# EAGLE design Pluvion 1 - Rev B (EAGLE 7.3.0)

## Sheet 1 of 3
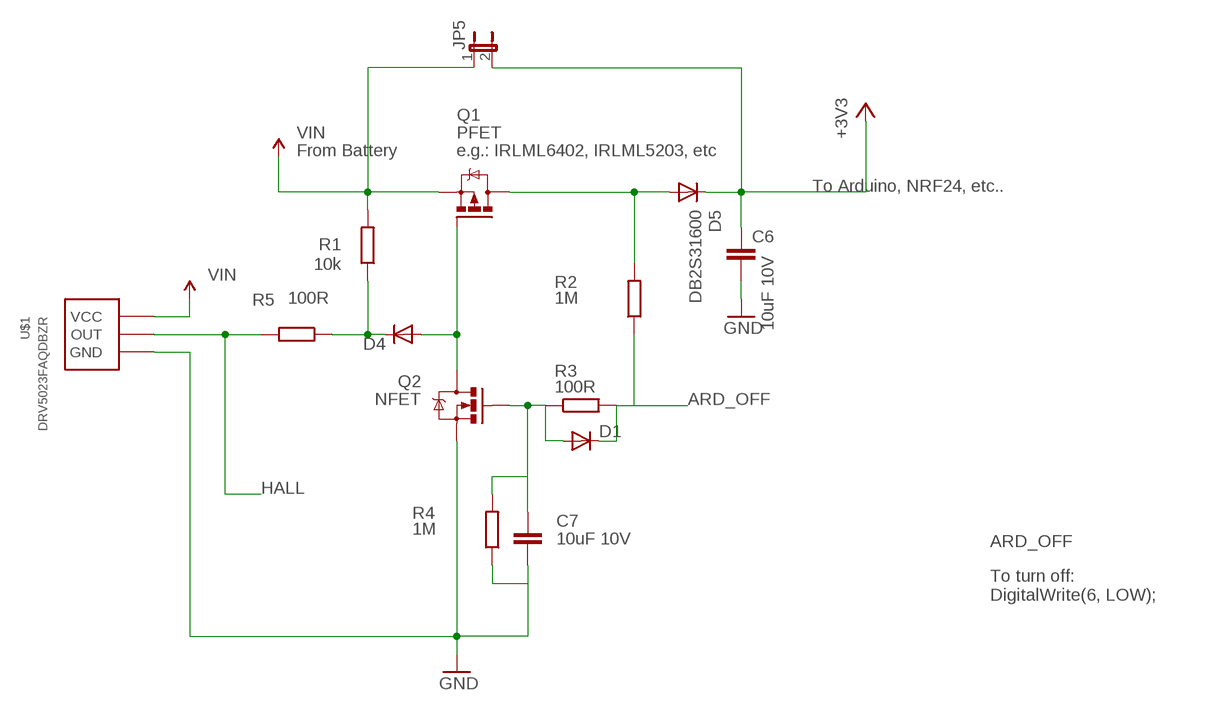
[diagram p0: schematic, sheet 1]

### Parts
C6  10uF 10V  C-EUC0805  [C0805]
C7  10uF 10V  C-EUC0805  [C0805]
D1  DIODESMB  [SMB-DIODE]
D4  DIODESMB  [SMB-DIODE]
D5  DB2S31600  DIODESMB  [SMB-DIODE]
JP5  JUMPER-2PTH  [1X02]
Q1  PFET  IRLML5203  [MICRO3]
Q2  NFET  MOSFET-NCHANNELBSS123LT1G  [SOT23]
R1  10k  R-EU_R0805  [R0805]
R2  1M  R-EU_R0805  [R0805]
R3  100R  R-EU_R0805  [R0805]
R4  1M  R-EU_R0805  [R0805]
R5  100R  R-EU_R0805  [R0805]
U$1  DRV5023FAQDBZR  [SOT23]

### Nets
+3V3: C6.1 D5.C JP5.2 ; also sheet 3
ARD_OFF: D1.C R2.1 R3.2 ; also sheet 3
BUTTONS: D4.A Q1.1(G) Q2.3(D)
GND: C6.2 C7.2 Q2.2(S) R4.1 U$1.3(GND) ; also sheet 3
HALL: R5.2 U$1.2(OUT)
N$1: D5.A Q1.3(D) R2.2
N$2: C7.1 D1.A Q2.1(G) R3.1 R4.2
N$8: D4.C R1.1 R5.1
VIN: JP5.1 Q1.2(S) R1.2 U$1.1(VCC)

### Notes on the sheet
- From Battery | e.g.: IRLML6402, IRLML5203, etc
- To Arduino, NRF24, etc..
- To turn off:
  DigitalWrite(6, LOW);

## Sheet 2 of 3

## Sheet 3 of 3
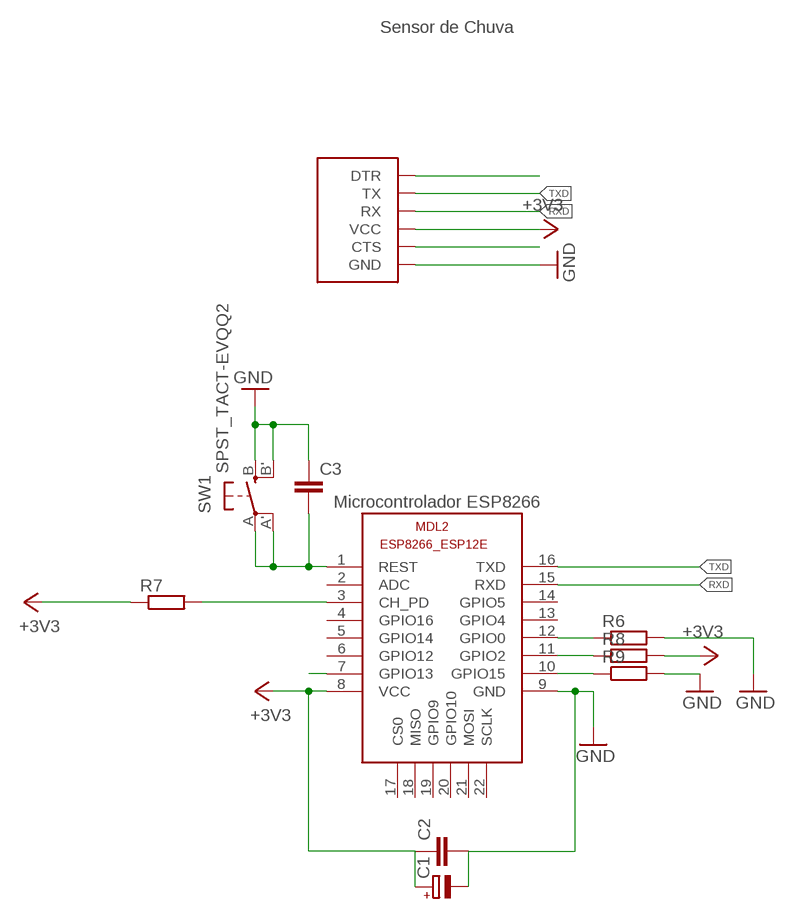
[diagram p1: schematic, sheet 3]

### Parts
C1  CPOL-EUC  [PANASONIC_C]
C2  C-EUC0805  [C0805]
C3  C-EUC0805  [C0805]
MDL2  ESP8266-12EESP8266-ESP12E  [ESP8266-ESP12E]
R6  R-EU_R0805  [R0805]
R7  R-EU_R0805  [R0805]
R8  R-EU_R0805  [R0805]
R9  R-EU_R0805  [R0805]
SW1  SPST_TACT-EVQQ2  [EVQ-Q2]
U$2  FTDI_HEADERSMD  [FTDI_HEADER_SMD]

### Nets
+3V3: C1.+ C2.1 MDL2.8(VCC) R7.1 R8.2 U$2.VCC ; also sheet 1
ARD_OFF: MDL2.7(GPIO13) ; also sheet 1
GND: C1.- C2.2 C3.1 MDL2.9(GND) R6.2 R9.2 SW1.B'(S1) SW1.B(S) U$2.GND ; also sheet 1
N$3: C3.2 MDL2.1(REST) SW1.A'(P1) SW1.A(P)
N$4: MDL2.3(CH_PD) R7.2
N$5: MDL2.12(GPIO0) R6.1
N$7: MDL2.11(GPIO2) R8.1
N$9: MDL2.10(GPIO15) R9.1
N$14: U$2.DTR
N$18: U$2.CTS
RXD: MDL2.15(RXD) U$2.RX
TXD: MDL2.16(TXD) U$2.TX
Unconnected: MDL2.2(ADC) MDL2.4(GPIO16) MDL2.5(GPIO14) MDL2.6(GPIO12) MDL2.13(GPIO4) MDL2.14(GPIO5) MDL2.17(CS0) MDL2.18(MISO) MDL2.19(GPIO9) MDL2.20(GPIO10) MDL2.21(MOSI) MDL2.22(SCLK)

### Notes on the sheet
- Sensor de Chuva
- Microcontrolador ESP8266

## Library data of the parts
C1 = wes:CPOL-EU: POLARIZED CAPACITOR, European symbol
C2 C3 C6 C7 = wes:C-EU: CAPACITOR, European symbol
D1 D4 D5 = SparkFun-DiscreteSemi:DIODE: Diode These are standard reverse protection diodes and small signal diodes. SMA package can handle up to about 1A. SOD-323 can handle about 200mA. What the SOD-323 package when ordering, there are some mfgs out there that are 5-pin packages.
JP5 = SparkFun-Passives:JUMPER-2: Jumper Basic 0.1" spaced jumper. Use with breakaway headers.
MDL2 = ESP8266-ESP12E:ESP8266-12E: ESP8266-12E with additional I/O and GPIO04/05 corrected The author cannot warrant that this library is free from error or will meet your specific requirements. Created by PuceBaboon.com. Komagane, Nagano, JAPAN
Q1 = transistor-power:IRLML5203: HEXFET P-Channel Power MOSFET
Q2 = SparkFun-DiscreteSemi:MOSFET-NCHANNEL: Common NMOSFET Parts MFG P/N Store ID Prod ID FDD8780 TRANS-09984 SI7820DN TRANS-11055 FDS6630A IC-08089 2N7002PW TRANS-11151 FQP30N06L COM-10213 TRANS-10060 BSS123LT1G TRANS-08345 BSS138 TRANS-00830 BS170 2N7000; PROD_ID: TRANS-08345
R1-R9 = wes:R-EU_: RESISTOR, European symbol
SW1 = adafruit:SPST_TACT: SMT 6mm switch, EVQQ2 series http://www.ladyada.net/library/eagle
U$1 = lib_pluvion:DRV5023FAQDBZR: Digital Switch Hall Sensor
U$2 = wes:FTDI_HEADER

## Board
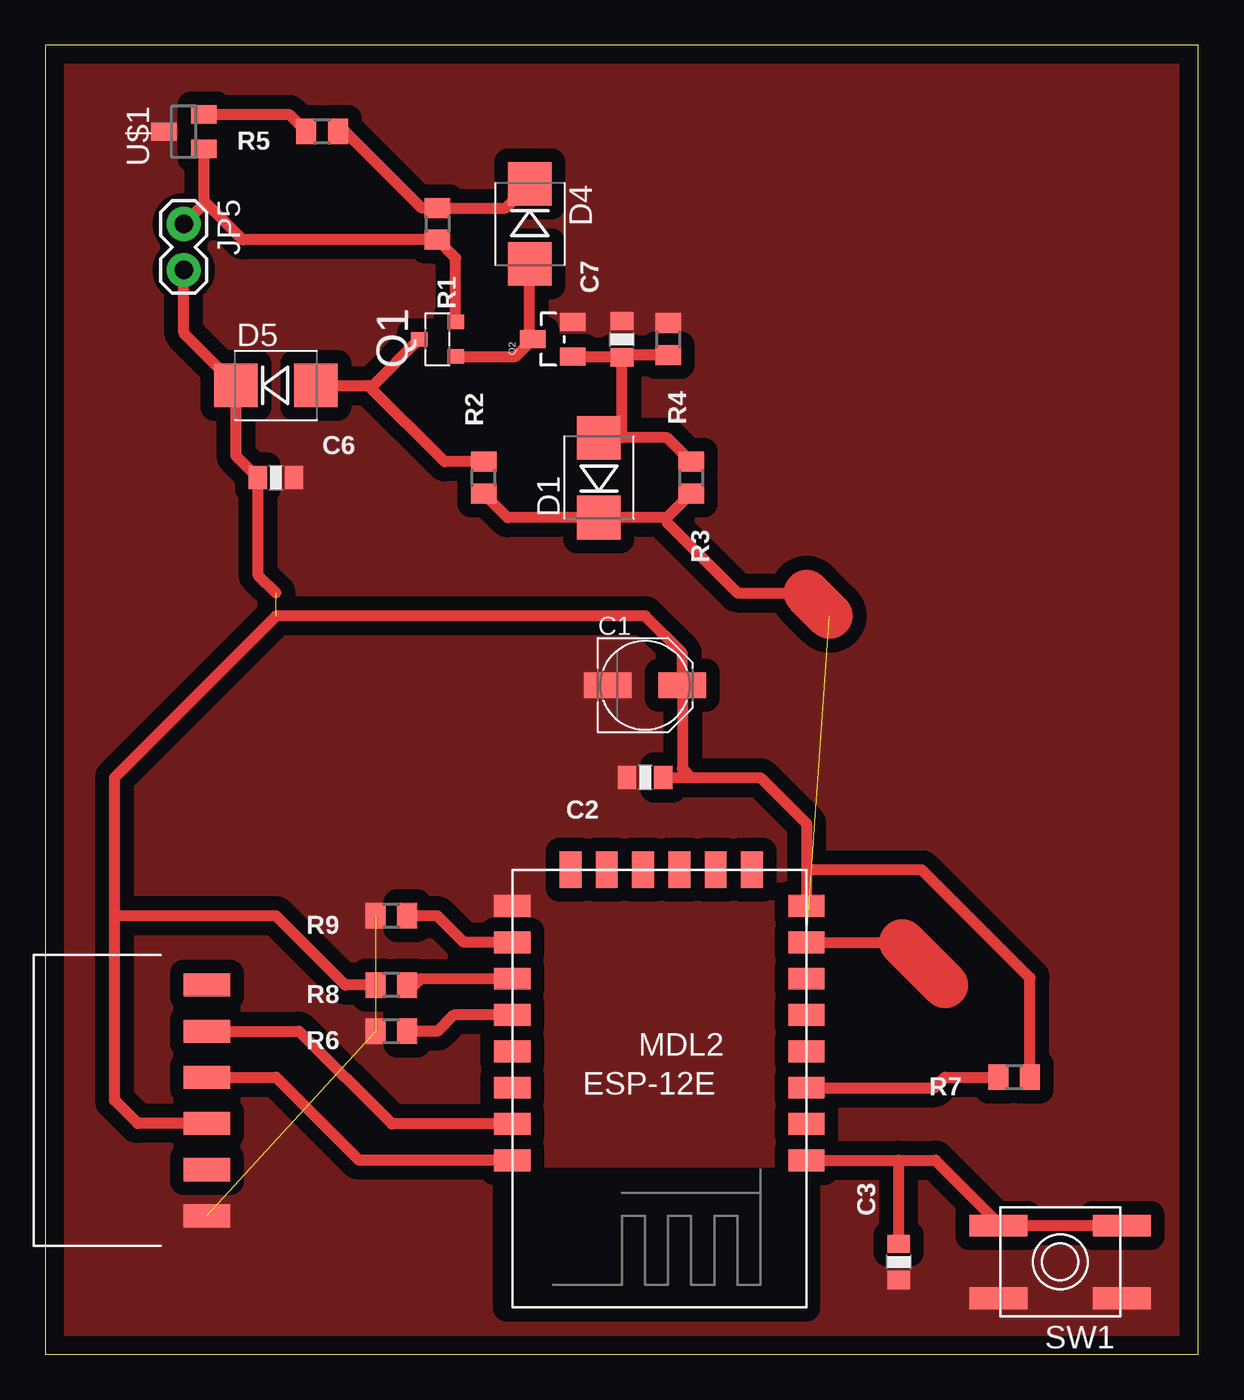
[diagram p2: board, top side]

Size 63.48 x 72.06 mm. Coordinates in mm from the lower left corner, seen from the top.
Outline: 0,0 63.48,0 63.48,72.06 0,72.06 0,0
Copper layers (1*16): Top 0.035mm / dielectric 1.5mm / Bottom 0.035mm
Design rules "default": minimum track width 10mil, minimum drill 0.6mm, track to track 8mil, track to pad 8mil, pad to pad 8mil, via to via 8mil, smd to smd 8mil, copper to edge 40mil, drill to drill 8mil, minimum pad ring 10mil, minimum via ring 8mil, stop-mask expansion 4mil, vias tented up to drill 0mil, thermal gap 10mil

### Footprints (pad centres in the part's own frame; a part is rotated, then mirrored left to right if it is on the bottom)
PANASONIC_C = smd 2.6 x 1.4: + 2.05,0; - -2.05,0
C0805 = smd 1 x 1.25: 1 -1,0; 2 1,0
SMB-DIODE = smd 2.4 x 2.4: A 2.2,0; C -2.2,0
1X02 = drill 1.016 pad 1.88: 1 0,0; 2 2.54,0
ESP8266-ESP12E = smd 2 x 1.2: 1 -7.62,5.84; 2 -7.62,3.84; 3 -7.62,1.84; 4 -7.62,-0.16; 5 -7.62,-2.16; 6 -7.62,-4.16; 7 -7.62,-6.16; 8 -7.62,-8.16; 9 8.58,-8.16; 10 8.58,-6.16; 11 8.58,-4.16; 12 8.58,-2.16; 13 8.58,-0.16; 14 8.58,1.84; 15 8.58,3.84; 16 8.58,5.84 | smd 1.2 x 2: 17 -4.62,-10.16; 18 -2.62,-10.16; 19 -0.62,-10.16; 20 1.38,-10.16; 21 3.38,-10.16; 22 5.38,-10.16
MICRO3 = smd 0.8 x 0.9: 1 -0.95,-1; 2 0.95,-1; 3 0,1
SOT23 = smd 1 x 1.4: 1 -0.95,-1.1; 2 0.95,-1.1; 3 0,1.1
R0805 = smd 1.1 x 1.4: 1 -0.875,0; 2 0.875,0
EVQ-Q2 = smd 3.2 x 1.2: A -3.4,-2; A' 3.4,-2; B -3.4,2; B' 3.4,2
FTDI_HEADER_SMD = smd 1.27 x 2.54: CTS -3.81,10.16; DTR 6.35,10.16; GND -6.35,10.16; RX 3.81,10.16; TX 1.27,10.16; VCC -1.27,10.16

### Placement (x,y rotation side)
C1  33.02,36.83 0 top
C2  33.02,31.75 180 top
C3  46.99,5.08 90 top
C6  12.7,48.26 0 top
C7  31.75,55.88 90 top
D1  30.48,48.26 90 top
D4  26.67,62.23 270 top
D5  12.7,53.34 0 top
JP5  7.62,62.23 270 top
MDL2  34.29,16.51 180 top
Q1  21.59,55.88 90 top
Q2  27.94,55.88 90 top
R1  21.59,62.23 270 top
R2  24.13,48.26 90 top
R3  35.56,48.26 270 top
R4  34.29,55.88 270 top
R5  15.24,67.31 180 top
R6  19.05,17.78 180 top
R7  53.34,15.24 180 top
R8  19.05,20.32 180 top
R9  19.05,24.13 180 top
SW1  55.88,5.08 180 top
U$1  7.62,67.31 90 top
U$2  19.05,13.97 90 top

### Tracks (layer width: path | path; a pad name or v marks a point on that pad's centre or on a via)
+3V3  (1 unrouted)
  Top 0.61: JP5.2 7.62,56.22 D5.C 10.5,49.46 C6.1 11.7,42.91 12.7,41.91 | C2.1 35.56,31.75 | 35.56,31.75 39.37,31.75 41.91,29.21 41.91,26.67 | 41.91,26.67 MDL2.8 | 35.56,31.75 35.07,32.24 C1.+ 35.07,38.59 33.02,40.64 12.7,40.64 3.81,31.75 3.81,24.13 | U$2.VCC 5.08,12.7 3.81,13.97 3.81,24.13 | R8.2 16.51,20.32 12.7,24.13 3.81,24.13 | R7.1 54.22,20.71 48.26,26.67 41.91,26.67
ARD_OFF  (1 unrouted)
  Top 0.61: R3.2 34.23,46.06 | 34.23,46.06 D1.C 25.45,46.06 R2.1 | MDL2.7 47.18,22.67 | 34.23,46.06 34.23,45.77 38.1,41.91 41.91,41.91
  Top 2.54: 47.18,22.67 49.53,20.32 | 41.91,41.91 43.18,40.64
BUTTONS
  Top 0.61: D4.A 26.67,56.05 Q2.3 25.89,54.93 Q1.1
GND  (2 unrouted)
  pour Top (isolate 0.762, no thermals): -10.16,73.66 90.17,73.66 90.17,-12.7 -10.16,-12.7
HALL
  Top 0.61: U$1.2 13.41,68.26 R5.2
N$1
  Top 0.61: D5.A 17.78,53.34 | 17.78,53.34 18.05,53.34 Q1.3 | R2.2 21.98,49.13 17.78,53.34
N$2
  Top 0.61: Q2.1 31.75,54.93 C7.1 | R4.2 31.75,55.01 C7.1 | C7.1 31.75,50.46 D1.A 34.23,50.46 R3.1
N$3
  Top 0.61: MDL2.1 46.99,10.67 | 46.99,10.67 49.02,10.67 52.48,7.21 SW1.A' SW1.A | C3.2 46.99,10.67
N$4
  Top 0.61: MDL2.3 48.96,14.67 49.53,15.24 R7.2
N$5
  Top 0.61: MDL2.12 22.48,18.67 21.59,17.78 R6.1
N$7
  Top 0.61: MDL2.11 20.67,20.67 20.32,20.32 R8.1
N$8
  Top 0.61: R5.1 16.51,67.31 20.71,63.1 R1.1 25.34,63.1 D4.C
N$9
  Top 0.61: MDL2.10 23.05,22.67 21.59,24.13 R9.1
RXD
  Top 0.61: U$2.RX 13.97,17.78 19.08,12.67 MDL2.15
TXD
  Top 0.61: U$2.TX 12.7,15.24 17.27,10.67 MDL2.16
VIN
  Top 0.61: Q1.2 22.59,60.35 R1.2 10.87,61.35 8.72,63.5 | U$1.1 8.72,63.5 | 8.72,63.5 8.72,63.33 JP5.1